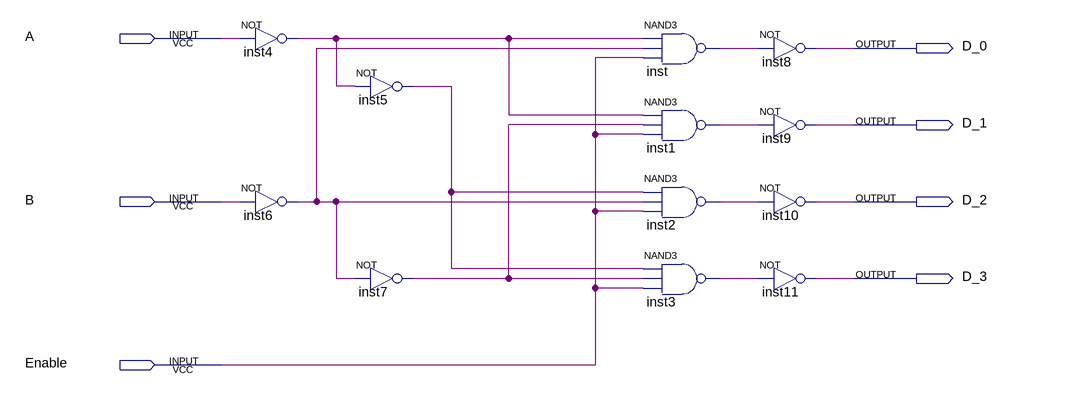
[diagram p0: schematic sheet]
// Quartus schematic MyDecoder_2_4.bdf as structural Verilog: 12 symbols, 7 pins
module MyDecoder_2_4 (
  input  A,
  input  B,
  input  Enable,
  output D_0,
  output D_1,
  output D_2,
  output D_3
);

  wire inst1_out, inst2_out, inst3_out, inst4_out, inst5_out, inst6_out, inst7_out, inst_out;

  not inst4 (inst4_out, A);
  not inst6 (inst6_out, B);
  not inst5 (inst5_out, inst4_out);
  not inst7 (inst7_out, inst6_out);
  nand inst (inst_out, inst4_out, inst6_out, Enable);
  nand inst1 (inst1_out, inst4_out, inst7_out, Enable);
  nand inst2 (inst2_out, inst5_out, inst6_out, Enable);
  nand inst3 (inst3_out, inst5_out, inst7_out, Enable);
  not inst8 (D_0, inst_out);
  not inst9 (D_1, inst1_out);
  not inst10 (D_2, inst2_out);
  not inst11 (D_3, inst3_out);
endmodule
